# EasyEDA Pro project WEN-验证模块合集.epro, schematic 验证板

## Sheets
1 加法器OPA690: Board Name: WEN-验证模块合集; Create Date: 2025-05-04; Page Name: 加法器OPA690; Project Name: 【电赛模块】2025电赛预制模块mmkk; Schematic Name: 验证板; Update Date: 2025-05-05; Company: 嘉立创EDA; Page Size: A1; Version: V1.0
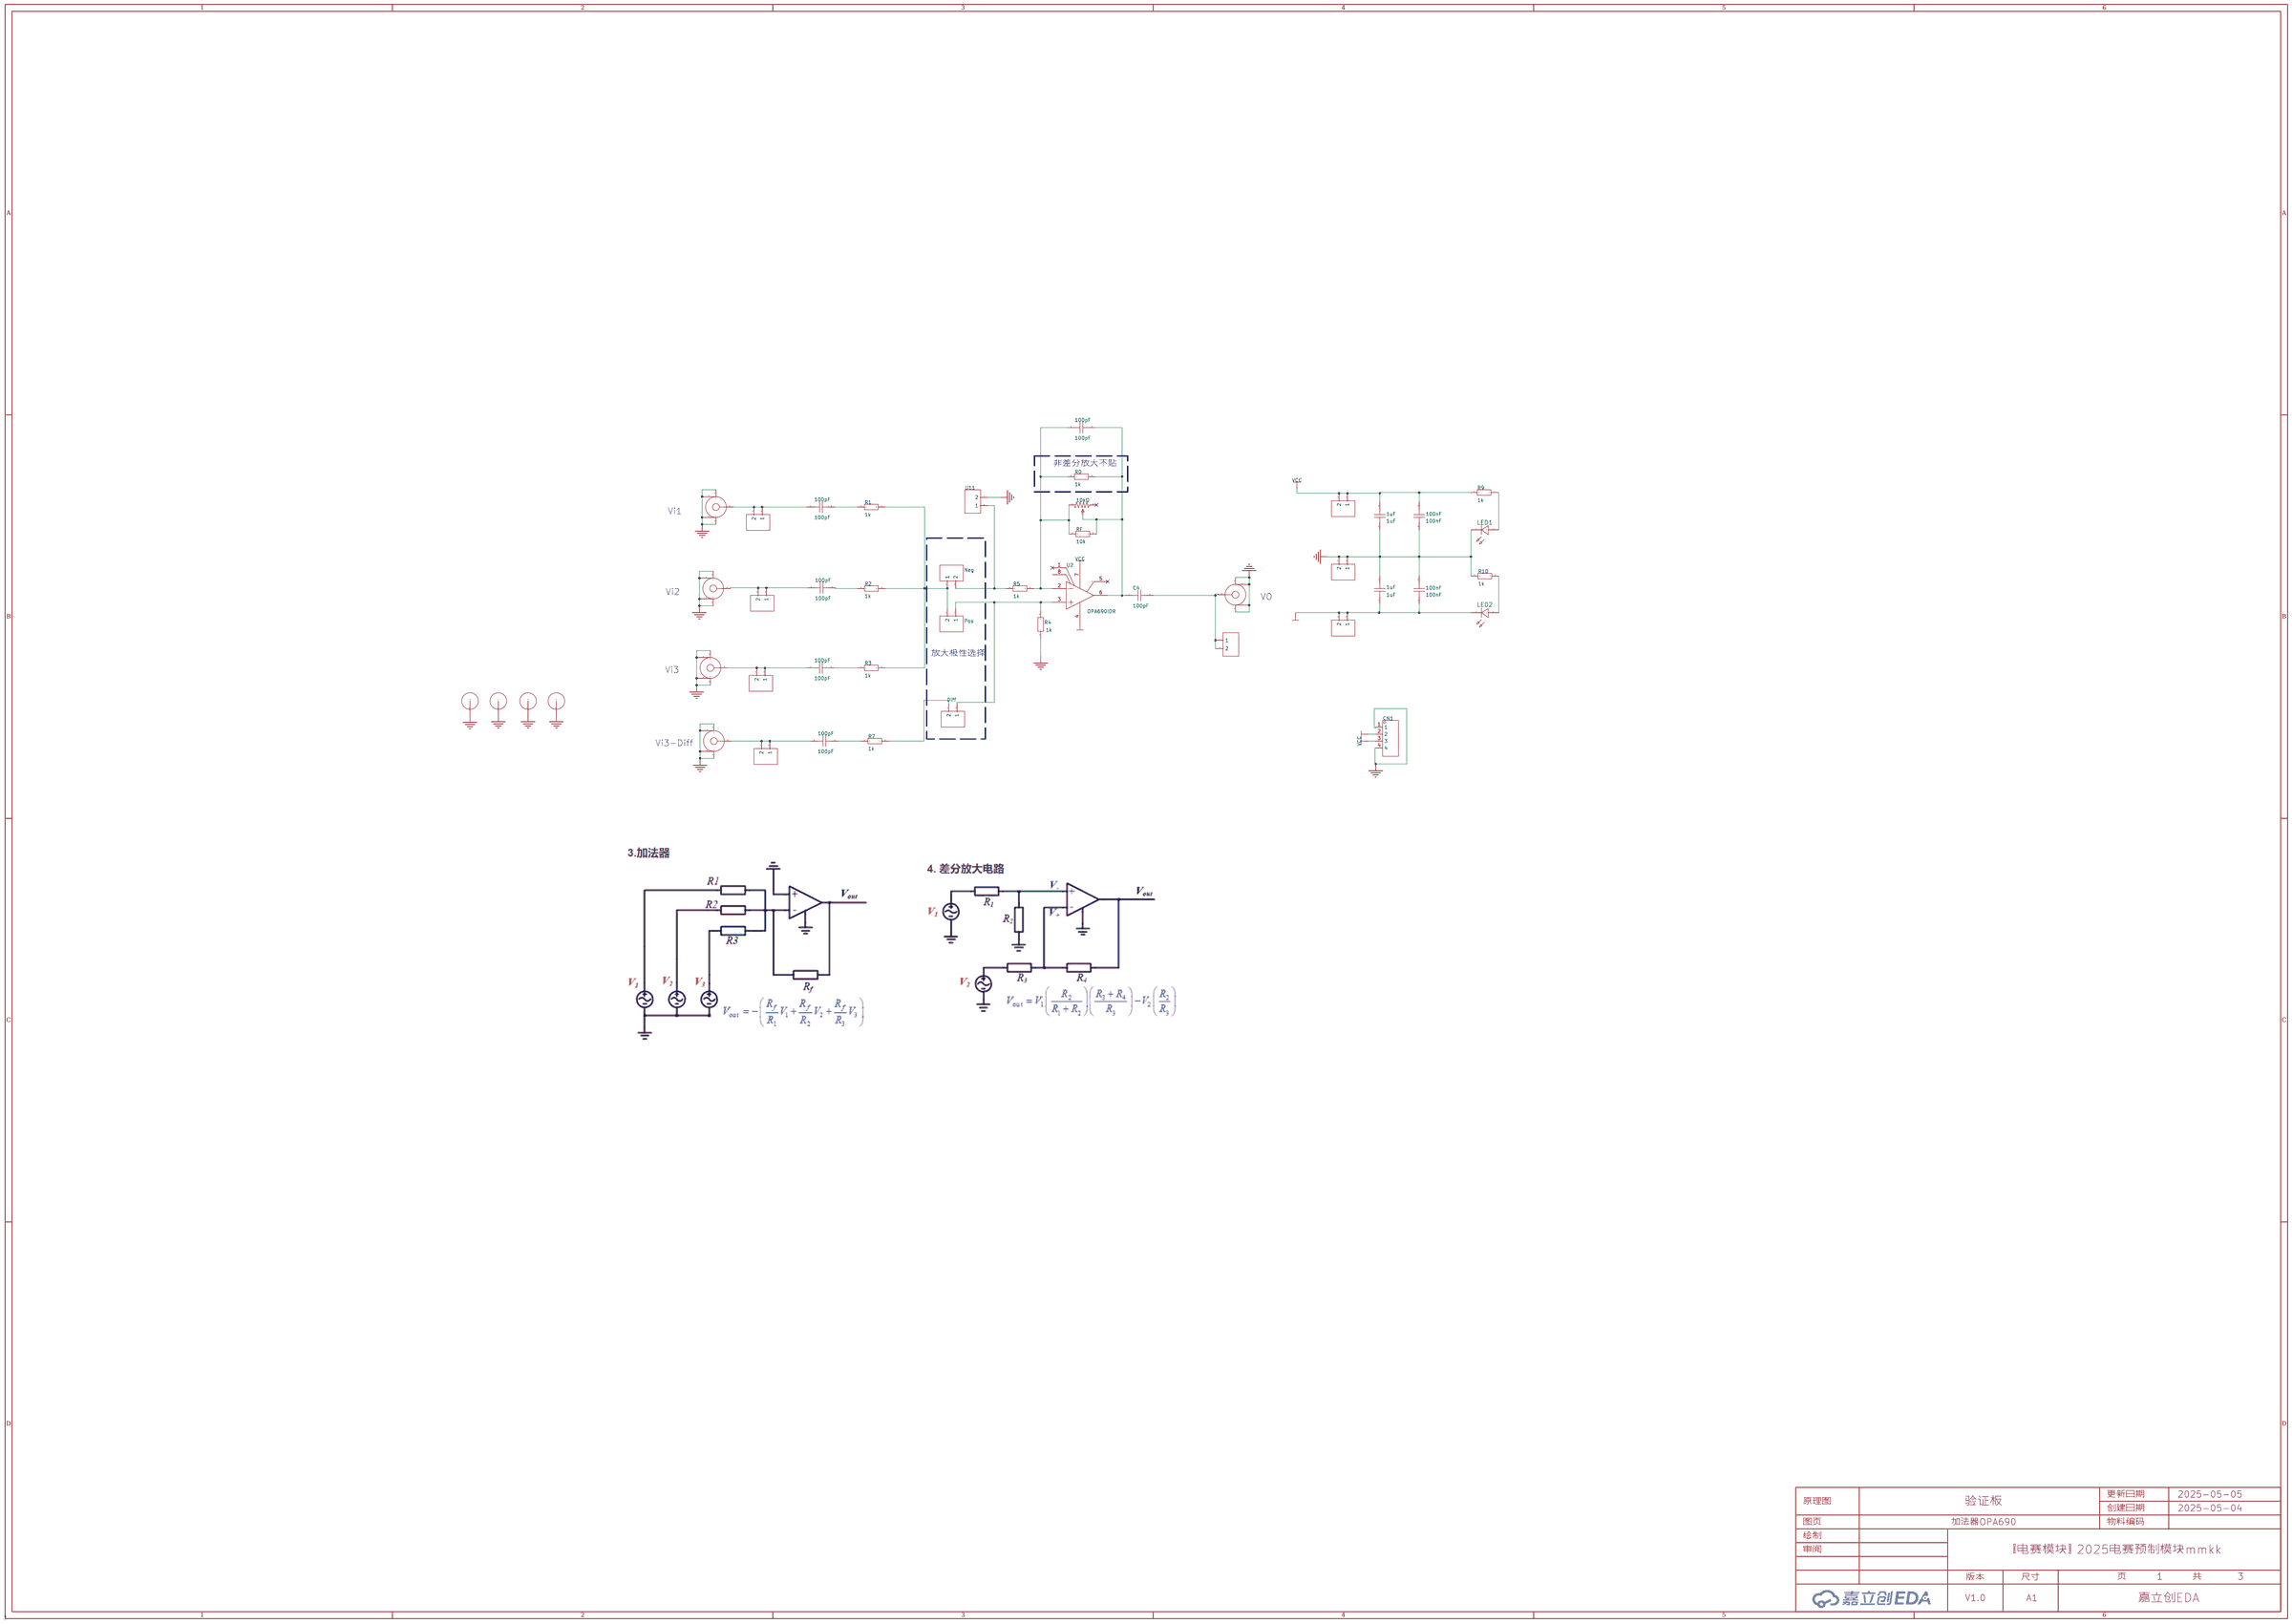
[diagram p0: 加法器OPA690]
2 程控滤波器MAX262: Page Name: 程控滤波器MAX262
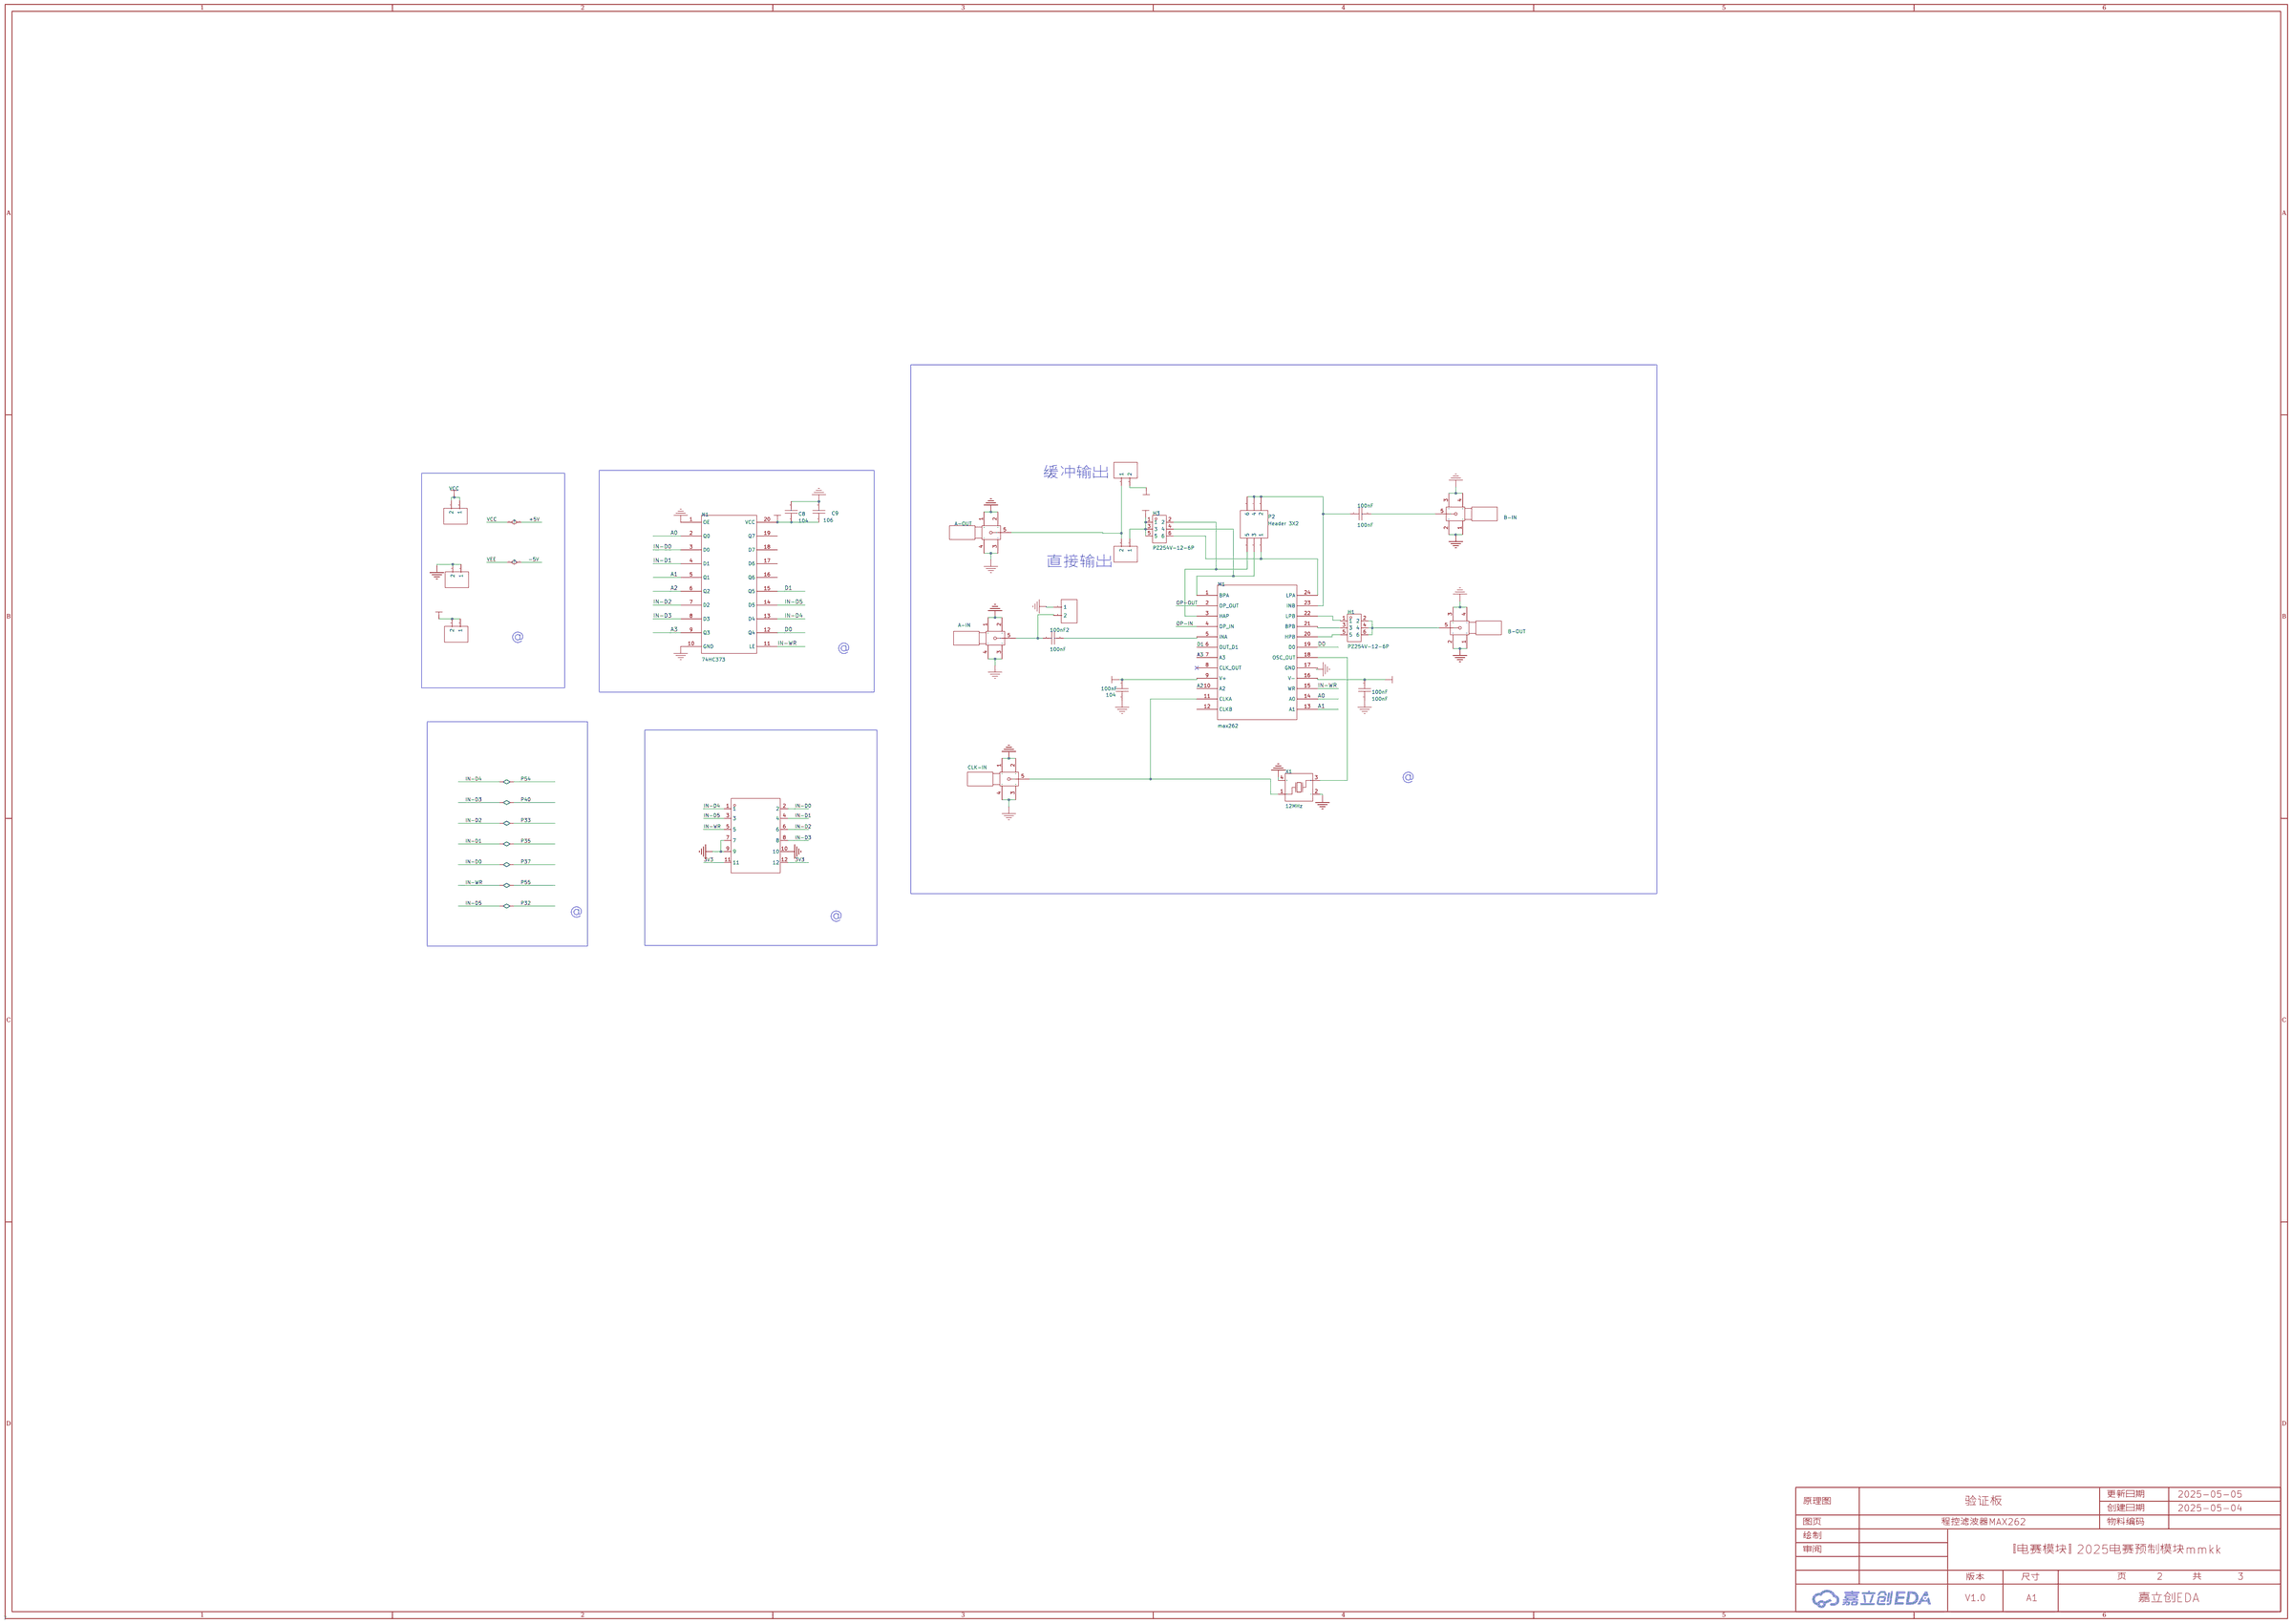
[diagram p1: 程控滤波器MAX262]
3 程控低通LTC1068: Page Name: 程控低通LTC1068
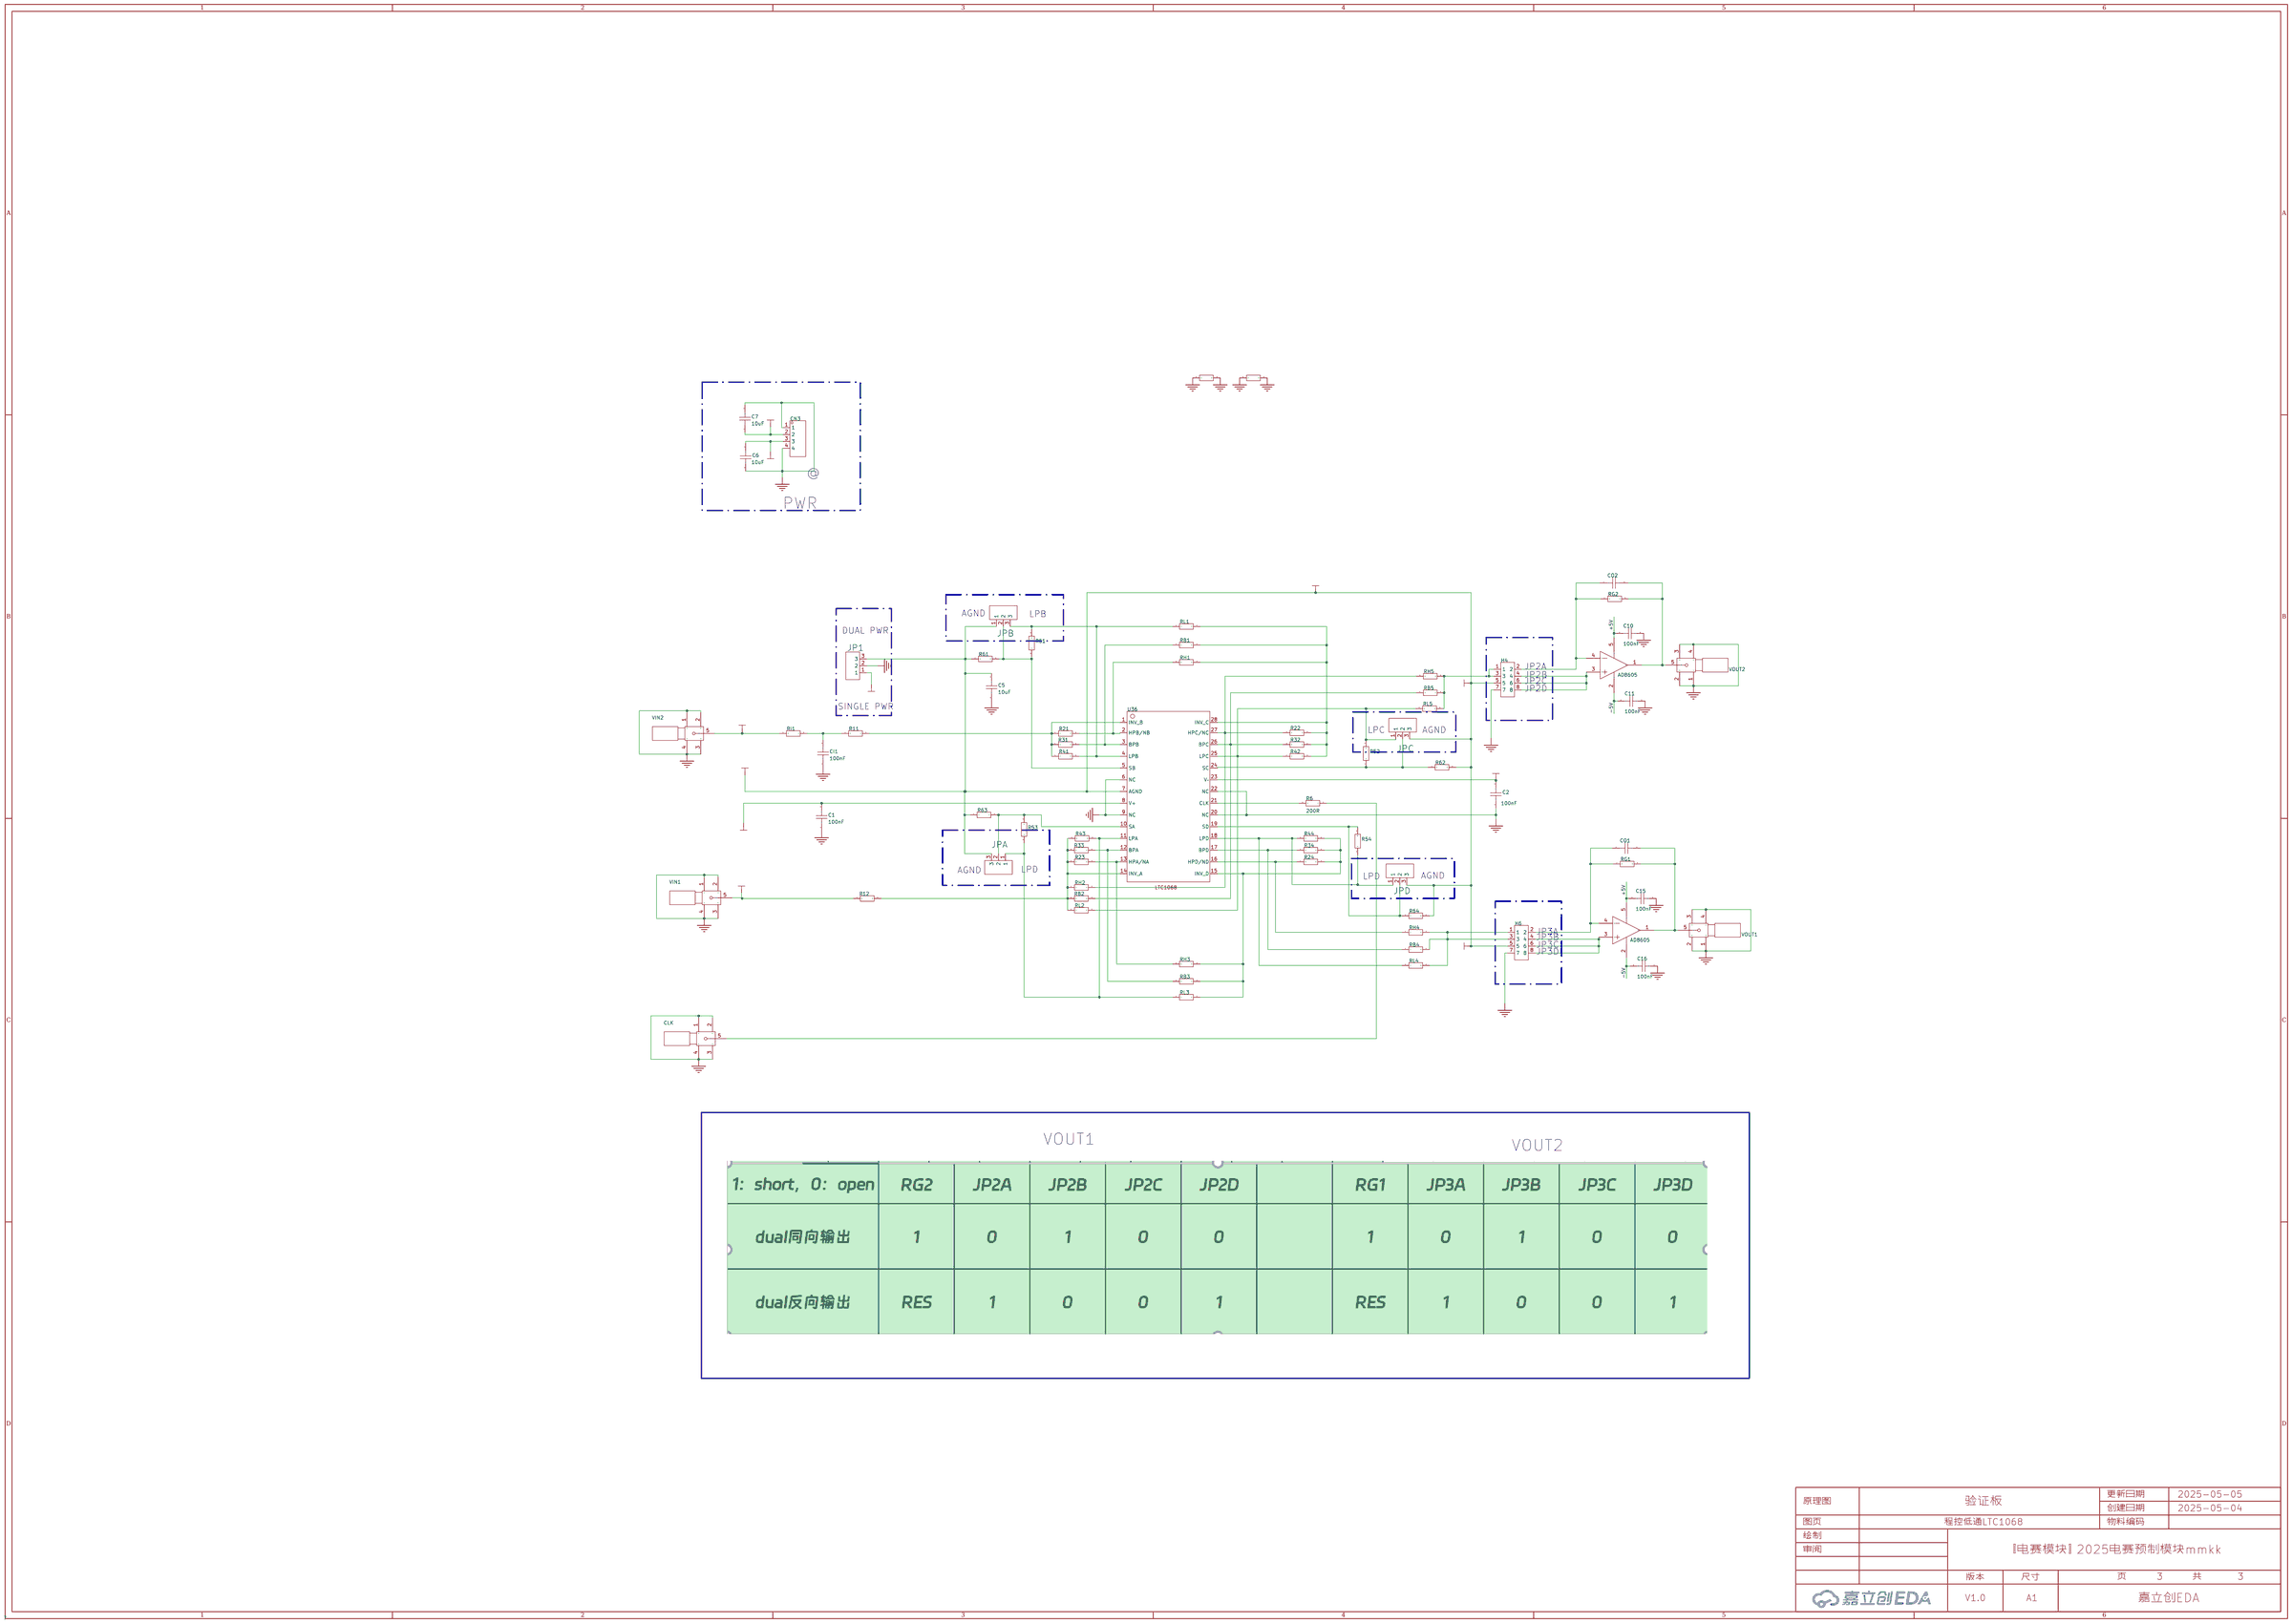
[diagram p2: 程控低通LTC1068]

## Parts
sheet 加法器OPA690
1uF  1uF  [C0805]
1uF#2  1uF  [C0805]
100nF  100nF  [C0805]
100nF#2  100nF  [C0805]
100pF  100pF  [C0805]
100pF#2  100pF  [C0805]
100pF#3  100pF  [C0805]
100pF#4  100pF  [C0805]
100pF#5  100pF  [C0805]
C4  100pF  [C0805]
CN1  WJ15EDGVC-3.81-4P  [CONN-TH_4P-P3.81_WJ2EDGVC-3.81-4P]
Diff  -  [2P-2.54]
LED1  -  [LED_0805]
LED2  -  [LED_0805]
Neg  -  [2P-2.54]
OUT-offset1  10kΩ  [RES-ADJ-TH_3P-L10.0-W10.0-P2.50-L]
Pos  -  [2P-2.54]
R1  1k  [R0805]
R2  1k  [R0805]
R3  1k  [R0805]
R4  1k  [R0805]
R5  1k  [R0805]
R7  1k  [R0805]
R9  1k  [R0805]
R10  1k  [R0805]
RD  1k  [R0805]
RF  10k  [R0805]
U2  OPA690IDR  [SOIC-8_L5.0-W4.0-P1.27-LS6.0-BL]
U3  -  [SMA-SMD_BWSMA-KE-P001]
U4  -  [SMA-SMD_BWSMA-KE-P001]
U6  -  [SMA-SMD_BWSMA-KE-P001]
U7  -  [SMA-SMD_BWSMA-KE-P001]
U8  -  [2P-2.54]
U11  -  [2P-2.54]
U12  -  [2P-2.54]
U14  -  [2P-2.54]
U15  -  [2P-2.54]
U17  -  [SMA-SMD_BWSMA-KE-P001]
U18  -  [2P-2.54]
U19  -  [2P-2.54]
U20  -  [2P-2.54]
U21  -  [2P-2.54]
U24  -  [My_M3螺丝孔]
U25  -  [My_M3螺丝孔]
U26  -  [My_M3螺丝孔]
U27  -  [My_M3螺丝孔]
sheet 程控低通LTC1068
C1  100nF  [C0805]
C2  100nF  [C0805]
C5  10uF  [C0805]
C6  10uF  [C0805]
C7  10uF  [C0805]
C10  100nF  [C0805]
C11  100nF  [C0805]
C15  100nF  [C0805]
C16  100nF  [C0805]
CI1  100nF  [C0805]
CLK  BWSMA-KE-Z001  [SMA-TH_BWSMA-KE-Z001]
CN3  WJ15EDGVC-3.81-4P  [CONN-TH_4P-P3.81_WJ2EDGVC-3.81-4P]
CO1  100nF  [C0805]
CO2  100nF  [C0805]
H4  PZ254V-12-8P  [HDR-TH_8P-P2.54-V-M-R2-C4-S2.54]
H6  PZ254V-12-8P  [HDR-TH_8P-P2.54-V-M-R2-C4-S2.54]
JP1  PZ254V-11-03P  [HDR-TH_3P-P2.54-V-M]
JPA  PZ254V-11-03P  [HDR-TH_3P-P2.54-V-M]
JPB  PZ254V-11-03P  [HDR-TH_3P-P2.54-V-M]
JPC  PZ254V-11-03P  [HDR-TH_3P-P2.54-V-M]
JPD  PZ254V-11-03P  [HDR-TH_3P-P2.54-V-M]
R6  200R  [R0805]
R11  1k  [R0805]
R12  1k  [R0805]
R21  1k  [R0805]
R22  1k  [R0805]
R23  1k  [R0805]
R24  1k  [R0805]
R31  1k  [R0805]
R32  1k  [R0805]
R33  1k  [R0805]
R34  1k  [R0805]
R41  1k  [R0805]
R42  1k  [R0805]
R43  1k  [R0805]
R44  1k  [R0805]
R51  1k  [R0805]
R52  1k  [R0805]
R53  1k  [R0805]
R54  1k  [R0805]
R61  1k  [R0805]
R62  1k  [R0805]
R63  1k  [R0805]
R64  1k  [R0805]
R65  1k  [R0805]
R67  1k  [R0805]
RB1  1k  [R0805]
RB2  1k  [R0805]
RB3  1k  [R0805]
RB4  1k  [R0805]
RB5  1k  [R0805]
RG1  1k  [R0805]
RG2  1k  [R0805]
RH1  1k  [R0805]
RH2  1k  [R0805]
RH3  1k  [R0805]
RH4  1k  [R0805]
RH5  1k  [R0805]
RI1  1k  [R0805]
RL1  1k  [R0805]
RL2  1k  [R0805]
RL3  1k  [R0805]
RL4  1k  [R0805]
RL5  1k  [R0805]
U36  -  [SSOP-28_L10.2-W5.3-P0.65-LS7.8-TL]
U38  AD8605  [SOT-23-5_L3.0-W1.7-P0.95-LS2.8-BR]
U40  AD8605  [SOT-23-5_L3.0-W1.7-P0.95-LS2.8-BR]
VIN1  BWSMA-KE-Z001  [SMA-TH_BWSMA-KE-Z001]
VIN2  BWSMA-KE-Z001  [SMA-TH_BWSMA-KE-Z001]
VOUT1  BWSMA-KE-Z001  [SMA-TH_BWSMA-KE-Z001]
VOUT2  BWSMA-KE-Z001  [SMA-TH_BWSMA-KE-Z001]
sheet 程控滤波器MAX262
100nF2  100nF  [C0805]
100nF#3  100nF  [C0805]
100nF#4  104  [C0805]
100nF#5  100nF  [C0805]
A-IN  BWSMA-KE-Z001  [SMA-TH_BWSMA-KE-Z001]
A-OUT  BWSMA-KE-Z001  [SMA-TH_BWSMA-KE-Z001]
B-IN  BWSMA-KE-Z001  [SMA-TH_BWSMA-KE-Z001]
B-OUT  BWSMA-KE-Z001  [SMA-TH_BWSMA-KE-Z001]
C8  104  [C0805]
C9  106  [C0805]
CLK-IN  BWSMA-KE-Z001  [SMA-TH_BWSMA-KE-Z001]
H1  PZ254V-12-6P  [HDR-TH_6P-P2.54-V-M-R2-C3-S2.54]
H3  PZ254V-12-6P  [HDR-TH_6P-P2.54-V-M-R2-C3-S2.54]
M1  max262  [SOIC-24_L15.4-W7.5-P1.27-LS10.3-BL]
N1  74HC373  [SOIC-20_L13.0-W7.6-P1.27-LS10.3-BL]
P2  Header 3X2  [HDR-TH_6P-P2.54-V-M-R2-C3-S2.54]
U28  -  [2P-2.54]
U29  -  [2P-2.54]
U30  -  [2P-2.54]
U32  -  [2P-2.54]
U33  -  [PMOD2X6P-2.54mm]
U34  -  [2P-2.54]
U35  -  [2P-2.54]
X1  12MHz  [CRYSTAL-SMD_4P-L3.2-W2.5-BL]

## Library data of the parts
1uF 1uF#2 100nF 100nF#2 100pF 100pF#2-100pF#5 C1 C2 C4-C7 C10 C11 C15 C16 CI1 CO1 CO2 = CAP_0805: Supplier Footprint: 0805
CN1 CN3 = WJ15EDGVC-3.81-4P: 连接器类型:板端/插座-闭口;固定方式:-;结构:1x4P;间距:3.81mm;颜色:-;安装方式:直针;排数:1;每排PIN数:4;额定电流:8A;额定电压:300V;线规 - AWG:-;线规 - 平方毫米:-;触头材质:黄铜;触头镀层:锡;工作温度范围:-40℃~+105℃;焊接温度(最大值):-;; LCSC Part Name: 1x4P 3.81mm 排数:1 每排P数:4; Supplier Part: C8410; Manufacturer: KANGNEX(康奈克斯电气); Supplier Footprint: 插件,P=3.81mm; JLCPCB Part Class: 扩展库; Datasheet: https://atta.szlcsc.com/upload/public/pdf/source/20191225/C8410_C8794F457058DA07325589F32B6A11CC.pdf; Supplier: LCSC; Connector Type: 板端/插座-闭口; Structure: 1x4P; Pitch: 3.81mm; Mounting Style: 直针; Number of Pins: 4P; Number of Rows: 1; Number of PINs Per Row: 4; Current Rating (Max): 8A; Voltage Rating (Max): 300V; Contact Material: 黄铜; Contact Plating: 锡; Operating Temperature Range: -40℃~+105℃
Diff Neg Pos U8 U11 U12 U14 U15 U18-U21 U28-U30 U32 U34 U35 = 2P-2.54
LED1 LED2 = LED_0805-R: Supplier Footprint: 0805
OUT-offset1 = 3296W-1-103: 阻值:10kΩ;精度:±10%;; LCSC Part Name: 10kΩ ±10%; Supplier Part: C118954; Manufacturer: BOCHEN(博晨); Supplier Footprint: 插件; JLCPCB Part Class: Extended Part; Datasheet: https://atta.szlcsc.com/upload/public/pdf/source/20171114/C118954_15106326646611117443.pdf; Supplier: LCSC; Tolerance: ±10%
R1-R7 R9-R12 R21-R24 R31-R34 R41-R44 R51-R54 R61-R65 R67 RB1-RB5 RD RF RG1 RG2 RH1-RH5 RI1 RL1-RL5 = 0805电阻
U2 = OPA690IDR: 放大器数:单路;增益带宽积(GBP):300MHz;压摆率(SR):1800V/us;输入偏置电流(Ib):3uA;; Supplier Part: C962539; Manufacturer: TI(德州仪器); Supplier Footprint: SOIC-8; JLCPCB Part Class: 扩展库; Datasheet: https://www.ti.com/cn/lit/gpn/opa690; Supplier: LCSC; Number of Circuits: 单路; Gain Bandwidth Product(GBP): 300MHz; Slew Rate(SR): 1800V/us; Current - Input Bias(Ib): 3uA; Quiescent Current: 5.5mA; Output Current: 190mA; Operating Temperature: -40℃~+85℃
U3 U4 U6 U7 U17 = 【电赛】-SMA
U24-U27 = My_M3螺丝孔
A-IN A-OUT B-IN B-OUT CLK CLK-IN VIN1 VIN2 VOUT1 VOUT2 = 【直插】BWSMA-KE-Z001_C496549: 连接器类型:板端;接口类型:内孔;端口数量:1;接口直径:-;接口长度/高度:-;频率-最大值:-;射频系列:SMA;阻抗:50Ω;样式:正脚;触头材质:-;触头镀层:-;工作温度范围:-65℃~+165℃;焊接温度(最大值):-;; LCSC Part Name: 内孔 SMA 正脚; Supplier Part: C496549; Manufacturer: BAT WIRELESS(蝙蝠无线); Supplier Footprint: 插件; JLCPCB Part Class: 扩展库; Datasheet: https://atta.szlcsc.com/upload/public/pdf/source/20221228/40BF41E56A06003A0210E1785CA66EA6.pdf; Supplier: LCSC; Connector Type: 板端; Interface Type: 内孔; Number of Ports: 1; RF Series: SMA; Impedance: 50Ω; Style: 正脚; Operating Temperature Range: -65℃~+165℃
H4 H6 = PZ254V-12-8P: 插针结构:2x4P;间距:2.54mm;行距:2.54mm;圆针/方针:方针;安装方式:直插;排数:双排;总PIN位数:8P;额定电流:-;额定电压:-;配合针长度:6mm;塑高:2.5mm;端接针长度:3mm;触头材质:黄铜;触头镀层:-;工作温度:-40℃~+105℃;颜色:黑色;; LCSC Part Name: 2x4P 间距:2.54mm 方针 直插; Supplier Part: C492421; Manufacturer: XFCN(兴飞); Supplier Footprint: 插件,P=2.54mm; JLCPCB Part Class: 扩展库; Datasheet: https://atta.szlcsc.com/upload/public/pdf/source/20200309/C492421_DC8A206AF99CD7755BD4A5B0BC48200B.pdf; Supplier: LCSC; Pin Structure: 2x4P; Pitch: 2.54mm; Row Spacing: 2.54mm; Circluar Pins/Square Pins: 方针; Mounting Type: 直插; Number of Rows: 双排; Number of Pins: 8P; Length of Mating Pin: 6mm; Insulation Height: 2.5mm; Length of End Connection Pin: 3mm; Contact Material: 黄铜; Operating Temperature: -40℃~+105℃; Color: 黑色
JP1 JPA JPB JPC JPD = PZ254V-11-03P: 插针结构:1x3P;间距:2.54mm;行距:-;圆针/方针:方针;安装方式:直插;排数:单排;总PIN位数:3P;额定电流:3A;额定电压:250V;配合针长度:6mm;塑高:2.5mm;端接针长度:3mm;工作温度:-40℃~+105℃;颜色:黑色;; LCSC Part Name: 1x3P 间距:2.54mm 方针 直插; Supplier Part: C2937625; Manufacturer: XFCN(兴飞); Supplier Footprint: 插件,P=2.54mm; JLCPCB Part Class: 扩展库; Datasheet: https://atta.szlcsc.com/upload/public/pdf/source/20200309/C492402_8335C3D49C4E4C618838D59BB1D024C1.pdf; Supplier: LCSC; Pin Structure: 1x3P; Pitch: 2.54mm; Circluar Pins/Square Pins: 方针; Mounting Type: 直插; Number of Rows: 单排; Number of Pins: 3P; Current Rating: 3A; Voltage Rating (Max): 250V; Length of Mating Pin: 6mm; Insulation Height: 2.5mm; Length of End Connection Pin: 3mm; Operating Temperature: -40℃~+105℃; Color: 黑色
U36 = LTC1068
U38 U40 = AD8605ARTZ-REEL7: 放大器数:单路;增益带宽积(GBP):10MHz;输入偏置电流(Ib):0.2pA;压摆率(SR):5V/us;轨到轨:-;; LCSC Part Name: 精密、低噪声、轨到轨输入输出、CMOS运算放大器（双路）; Supplier Part: C9641; Manufacturer: ADI(亚德诺); Supplier Footprint: SOT-23-5; JLCPCB Part Class: 扩展库; Datasheet: https://atta.szlcsc.com/upload/public/pdf/source/20121029/1457706543879.pdf; Supplier: LCSC; Number of Circuits: 单路; Gain Bandwidth Product(GBP): 10MHz; Current - Input Bias(Ib): 0.2pA; Slew Rate(SR): 5V/us; Output Current: 80mA; Operating Temperature: -40℃~+125℃
100nF2 100nF#3-100nF#5 C8 = 104
C9 = 106
H1 H3 = PZ254V-12-6P: 插针结构:2x3P;间距:2.54mm;行距:2.54mm;圆针/方针:方针;安装类型:直插;排数:双排;总PIN位数:6P;额定电流:-;额定电压:-;配合针长度:6mm;塑高:2.5mm;端接针长度:3mm;触头材质:黄铜;触头镀层:-;工作温度范围:-40℃~+105℃;颜色:黑色;; LCSC Part Name: 间距:2.54mm 2x3P 直插 方针; Supplier Part: C492420; Manufacturer: XFCN(兴飞); Supplier Footprint: 插件,P=2.54mm; JLCPCB Part Class: Extended Part; Datasheet: https://atta.szlcsc.com/upload/public/pdf/source/20200309/C492420_BAECB307B001054C09D200388220EAE6.pdf; Supplier: LCSC; Pin Structure: 2x3P; Pitch: 2.54mm; Row Spacing: 2.54mm; Circluar Pins/Square Pins: 方针; Mounting Type: 直插; Number of Rows: 双排; Number of Pins: 6P; Length of Mating Pin: 6mm; Insulation Height: 2.5mm; Length of End Connection Pin: 3mm; Contact Material: 黄铜; Operating Temperature Range: -40℃~+105℃; Color: 黑色
M1 = max262
N1 = 74HC373
P2 = Header 3X2: LatestRevisionDate: 17-Jul-2002; LatestRevisionNote: Re-released for DXP Platform.; Publisher: Altium Limited
U33 = PMOD2X6P-2.54mm
X1 = X322512MSB4SI: 晶振类型:贴片晶振;频率:12MHz;常温频差:±10ppm;外接负载电容:20pF;频率稳定度(全温):±20ppm;; LCSC Part Name: 12MHz ±10ppm 20pF; Supplier Part: C9002; Manufacturer: YXC(扬兴晶振); Supplier Footprint: SMD3225-4P; JLCPCB Part Class: 基础库; Datasheet: https://atta.szlcsc.com/upload/public/pdf/source/20240329/19D5F850207469550BEB00D7DFEDBC7A.pdf; Supplier: LCSC; Crystal Type: 贴片晶振; Normal temperature Frequency Tolerance: ±10ppm; External load capacitor: 20pF; Frequency Stability(Full temperature range): ±20ppm; Operating Temperature: -40℃~+85℃

## Nets
3V3: U33.11 U33.12
+5V: 1uF.2 100nF.2 100nF#4.1 C1.2 C7.1 C8.1 C9.1 C10.1 C15.1 CN1.3 CN3.2 M1.9(V+) N1.20(VCC) R9.2 U2.7(+VS) U19.1 U19.2 U28.1 U28.2 U36.8(V+) U38.5(+V) U40.5(+V)
-5V: 1uF#2.1 100nF#2.1 100nF#3.1 C2.2 C6.2 C11.1 C16.1 CN1.2 CN3.3 JP1.1 LED2.1(C) M1.16(V-) U2.4(-VS) U21.1 U21.2 U30.1 U30.2 U36.23(V–) U38.2(-V) U40.2(-V)
AGND: C5.1 H4.5 H6.5 JP1.3 JPA.3 JPB.1 JPC.3 JPD.3 R61.1 R62.2 R63.1 R64.2 U36.7(AGND)
GND: 1uF.1 1uF#2.2 100nF.1 100nF#2.2 100nF#3.2 100nF#4.2 A-IN.1 A-IN.2 A-IN.3 A-IN.4 A-OUT.1 A-OUT.2 A-OUT.3 A-OUT.4 B-IN.1 B-IN.2 B-IN.3 B-IN.4 B-OUT.1 B-OUT.2 B-OUT.3 B-OUT.4 C1.1 C2.1 C5.2 C6.1 C7.2 C8.2 C9.2 C10.2 C11.2 C15.2 C16.2 CI1.1 CLK.1 CLK.2 CLK.3 CLK.4 CLK-IN.1 CLK-IN.2 CLK-IN.3 CLK-IN.4 CN1.1 CN1.4 CN3.1 CN3.4 H4.7 H6.7 JP1.2 LED1.1(C) M1.17(GND) N1.1(OE) N1.10(GND) R4.1 R10.2 R65.1 R65.2 R67.1 R67.2 U3.1 U3.2 U3.3 U3.4 U4.1 U4.2 U4.3 U4.4 U6.1 U6.2 U6.3 U6.4 U7.1 U7.2 U7.3 U7.4 U11.2 U17.1 U17.2 U17.3 U17.4 U20.1 U20.2 U24.1 U25.1 U26.1 U27.1 U29.1 U29.2 U32.1 U33.7 U33.9 U33.10 U36.6(NC) U36.9(NC) U36.20(NC) U36.22(NC) VIN1.1 VIN1.2 VIN1.3 VIN1.4 VIN2.1 VIN2.2 VIN2.3 VIN2.4 VOUT1.1 VOUT1.2 VOUT1.3 VOUT1.4 VOUT2.1 VOUT2.2 VOUT2.3 VOUT2.4 X1.2(GND) X1.4(GND)
VIN1: R12.1 VIN1.5
VIN2: RI1.1 VIN2.5
A0: M1.14(A0) N1.2(Q0)
A1: M1.13(A1) N1.5(Q1)
A2: M1.10(A2) N1.6(Q2)
A3: M1.7(A3) N1.9(Q3)
D0: M1.19(D0) N1.12(Q4)
D1: M1.6(OUT D1) N1.15(Q5)
IN-D0: N1.3(D0) U33.2
IN-D1: N1.4(D1) U33.4
IN-D2: N1.7(D2) U33.6
IN-D3: N1.8(D3) U33.8
IN-D4: N1.13(D4) U33.1
IN-D5: N1.14(D5) U33.3
IN-WR: M1.15(WR) N1.11(LE) U33.5
OP-IN: H3.1 H3.3 H3.5 M1.4(OP IN) U34.1
OP-OUT: M1.2(OP OUT) U35.2
$1N3268: C4.2 U7.5 U8.1 U8.2
$1N3998: LED1.2(A) R9.1
$1N4082: LED2.2(A) R10.1
$2N1385: H3.2 M1.3(HAP) P2.5
$2N1386: H3.6 M1.24(LPA) P2.1
$2N1387: H3.4 M1.1(BPA) P2.3
$2N1398: H1.5 M1.20(HPB)
$2N1399: H1.3 M1.21(BPB)
$2N1463: M1.18(OSC OUT) X1.3(OSC2)
$2N4736: H1.1 M1.22(LPB)
$2N4759: B-OUT.5 H1.2 H1.4 H1.6
$2N7543: CLK-IN.5 M1.11(CLKA) X1.1(OSC1)
$3N1782: R22.2 R32.2 R42.2 RB1.2 RH1.2 RL1.2 U36.28(INV_C)
$3N1872: JPC.1 R42.1 R52.2 RL2.2 RL5.1 U36.25(LPC)
$3N1876: R32.1 RB2.2 RB5.1 U36.26(BPC)
$3N1878: R22.1 RH2.2 RH5.1 U36.27(HPC/NC)
$3N2792: H4.1 H4.3 RB5.2 RH5.2 RL5.2
$3N3003: R21.2 RH1.1 U36.2(HPB/NB)
$3N3008: R31.2 RB1.1 U36.3(BPB)
$3N3022: R11.2 R21.1 R31.1 R41.1 U36.1(INV_B)
$3N3099: CI1.2 R11.1 RI1.2
$3N4167: R33.2 RB3.1 U36.12(BPA)
$3N4172: R23.2 RH3.1 U36.13(HPA/NA)
$3N4596: R24.2 R34.2 R44.2 RB3.2 RH3.2 RL3.2 U36.15(INV_D)
$3N4603: JPD.1 R44.1 R54.1 RL4.1 U36.18(LPD)
$3N4605: R24.1 RH4.1 U36.16(HPD/ND)
$3N4661: R34.1 RB4.1 U36.17(BPD)
$3N4977: JPD.2 R54.2 R64.1 U36.19(SD)
$3N5493: H6.1 H6.3 RB4.2 RH4.2 RL4.2
$3N6100: JPC.2 R52.1 R62.1 U36.24(SC)
$3N6540: R12.2 R23.1 R33.1 R43.1 RB2.1 RH2.1 RL2.1 U36.14(INV_A)
Net-(100nF2-1): 100nF2.1 A-IN.5 U32.2
Net-(100nF2-2): 100nF2.2 M1.5(INA)
Net-(100nF#5-1): 100nF#5.1 M1.23(INB) P2.2 P2.4 P2.6
Net-(100nF#5-2): 100nF#5.2 B-IN.5
Net-(100pF#2-1): 100pF#2.1 U3.5 U15.1 U15.2
Net-(100pF#2-2): 100pF#2.2 R2.1
Net-(100pF#3-1): 100pF#3.1 U6.5 U14.1 U14.2
Net-(100pF#3-2): 100pF#3.2 R3.1
Net-(100pF#4-1): 100pF#4.1 U17.5 U18.1 U18.2
Net-(100pF#4-2): 100pF#4.2 R7.1
Net-(100pF#5-1): 100pF#5.1 OUT-offset1.1 R5.1 RD.1 RF.1 U2.2(IN-)
Net-(100pF#5-2): 100pF#5.2 C4.1 OUT-offset1.2 RD.2 RF.2 U2.6(OUT)
Net-(100pF-1): 100pF.1 U4.5 U12.1 U12.2
Net-(100pF-2): 100pF.2 R1.1
Net-(A-OUT-5): A-OUT.5 U34.2 U35.1
Net-(CLK-5): CLK.5 R6.1
Net-(CO1-1): CO1.1 H6.2 RG1.1 U40.4(-IN)
Net-(CO1-2): CO1.2 RG1.2 U40.1(OUT) VOUT1.5
Net-(CO2-1): CO2.1 H4.2 RG2.1 U38.4(-IN)
Net-(CO2-2): CO2.2 RG2.2 U38.1(OUT) VOUT2.5
Net-(Diff-1): Diff.1 Pos.1 R4.2 U2.3(IN+)
Net-(Diff-2): Diff.2 R7.2
Net-(H4-4): H4.4 H4.6 H4.8 U38.3(+IN)
Net-(H6-4): H6.4 H6.6 H6.8 U40.3(+IN)
Net-(JPA-1): JPA.1 R43.2 R53.1 RL3.1 U36.11(LPA)
Net-(JPA-2): JPA.2 R53.2 R63.2 U36.10(SA)
Net-(JPB-2): JPB.2 R51.1 R61.2 U36.5(SB)
Net-(JPB-3): JPB.3 R41.2 R51.2 RL1.1 U36.4(LPB)
Net-(Neg-1): Neg.1 Pos.2 R1.2 R2.2 R3.2
Net-(Neg-2): Neg.2 R5.2 U11.1
Net-(R6-2): R6.2 U36.21(CLK)

Not connected (* = marked no-connect by the designer): M1 8(CLK OUT)* 12(CLKB); N1 16(Q6) 17(D6) 18(D7) 19(Q7); OUT-offset1 3*; U2 1(NC)* 5(NC)* 8(DIS#)

## Notes on the sheets
sheet 1
- 非差分放大不贴
- Vi1
- Vi2
- VO
- 放大极性选择
- Vi3
- Vi3-Diff
sheet 2
- 缓冲输出
- 直接输出
- @
- @
- @
- @
- @
sheet 3
- @
- PWR
- AGND
- LPB
- DUAL PWR
- JP2A
- JP2B
- JP2C
- JP2D
- SINGLE PWR
- LPC
- AGND
- AGND
- LPD
- LPD
- AGND
- JP3A
- JP3B
- JP3C
- JP3D
- VOUT1
- VOUT2
